# EAGLE schematic untitled (EAGLE 5.10)
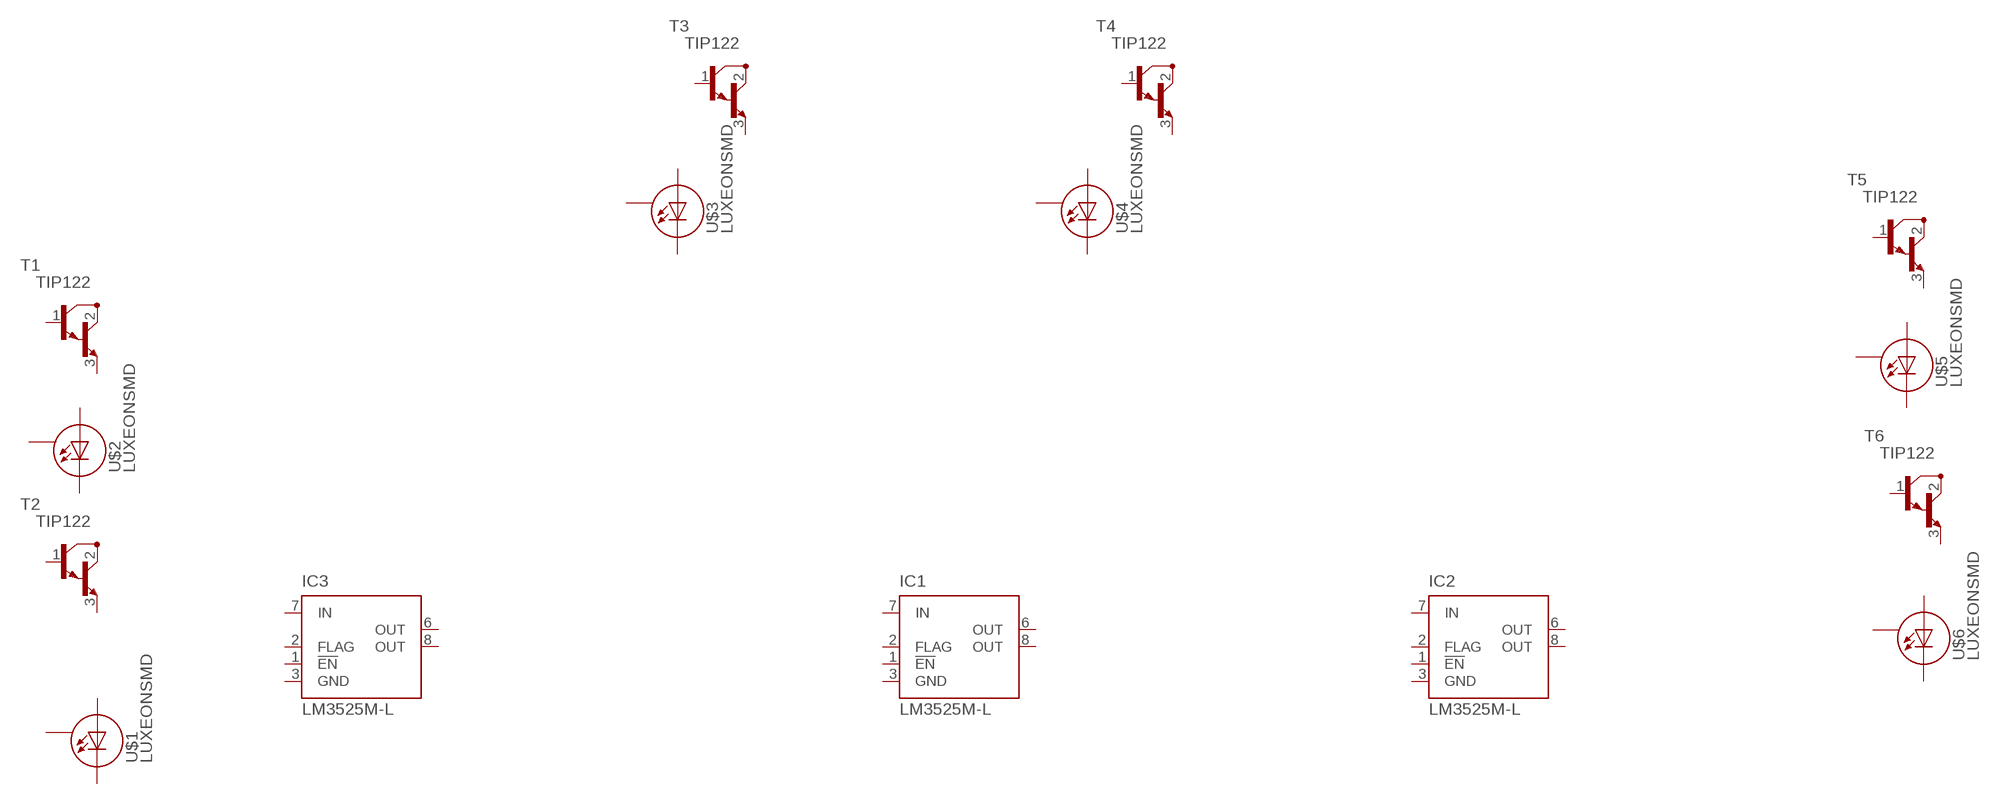
[diagram p0: schematic, sheet 1]

## Parts
IC1  LM3525M-L  [SO08]
IC2  LM3525M-L  [SO08]
IC3  LM3525M-L  [SO08]
T1  TIP122  [TO220]
T2  TIP122  [TO220]
T3  TIP122  [TO220]
T4  TIP122  [TO220]
T5  TIP122  [TO220]
T6  TIP122  [TO220]
U$1  LUXEONSMD  [LUXEON]
U$2  LUXEONSMD  [LUXEON]
U$3  LUXEONSMD  [LUXEON]
U$4  LUXEONSMD  [LUXEON]
U$5  LUXEONSMD  [LUXEON]
U$6  LUXEONSMD  [LUXEON]
Unconnected: IC1.1(!EN) IC1.2(FLAG) IC1.4(NC) IC1.5(NC) IC1.6(OUT) IC1.7(IN) IC1.8(OUT) IC2.1(!EN) IC2.2(FLAG) IC2.4(NC) IC2.5(NC) IC2.6(OUT) IC2.7(IN) IC2.8(OUT) IC3.1(!EN) IC3.2(FLAG) IC3.4(NC) IC3.5(NC) IC3.6(OUT) IC3.7(IN) IC3.8(OUT) T1.1(B) T1.2(C) T1.3(E) T2.1(B) T2.2(C) T2.3(E) T3.1(B) T3.2(C) T3.3(E) T4.1(B) T4.2(C) T4.3(E) T5.1(B) T5.2(C) T5.3(E) T6.1(B) T6.2(C) T6.3(E) U$1.A U$1.C U$1.S U$2.A U$2.C U$2.S U$3.A U$3.C U$3.S U$4.A U$4.C U$4.S U$5.A U$5.C U$5.S U$6.A U$6.C U$6.S

## Power pins joined to a net without a drawn wire
GND: IC1.3(GND) IC2.3(GND) IC3.3(GND)

## Library data of the parts
IC1-IC3 = linear:LM3525M-L: Single Port USB Power Switch and Over-Current Protection LOW active Source: http://cache.national.com/ds/LM/LM3525.pdf
T1-T6 = transistor:TIP122: NPN BIPOLAR DARLINGTON TRANSISTOR
U$1-U$6 = SparkFun:LUXEON: Luxeon LED This footprint works with the current 1 Watt, 3 Watt, and 5 Watt LEDs. These blindingly bright LEDs generate a lot of heat so the footprint has a large pad under the LED for thermal transfer. Schematic and footprint are proven. Spark Fun Electronics SKU : COM-00603